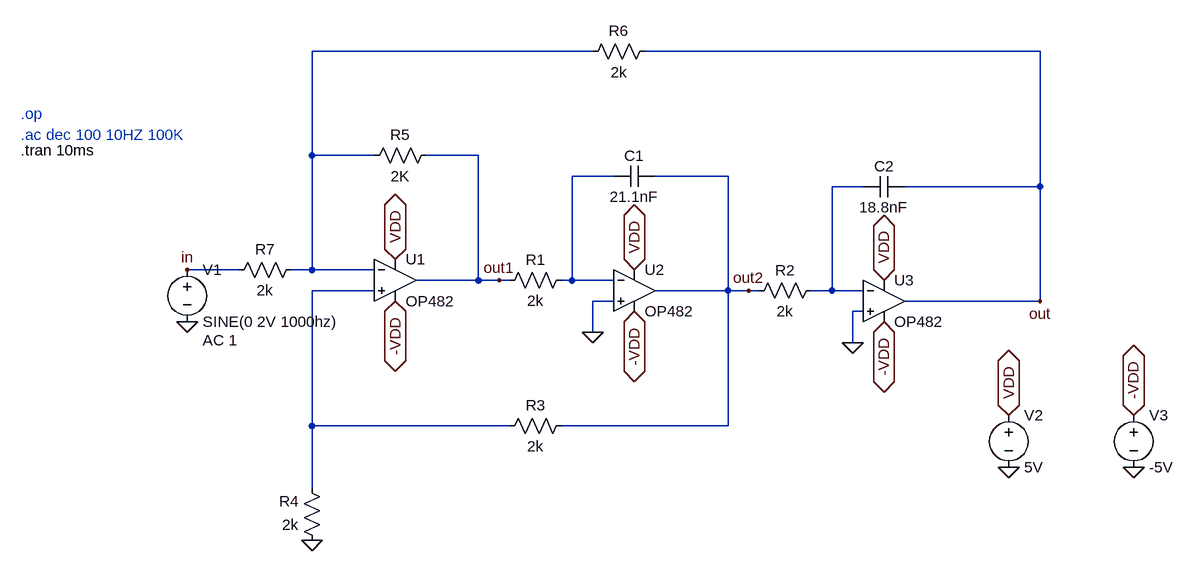
[diagram p0: schematic Draft2.asc]
Draft2.asc, the LTspice schematic file:
Version 4.1
SHEET 1 1144 680
WIRE 224 -320 -208 -320
WIRE 912 -320 304 -320
WIRE -208 -160 -208 -320
WIRE -112 -160 -208 -160
WIRE 48 -160 -32 -160
WIRE 256 -128 192 -128
WIRE 432 -128 320 -128
WIRE 640 -112 592 -112
WIRE 912 -112 912 -320
WIRE 912 -112 704 -112
WIRE -320 16 -400 16
WIRE -208 16 -208 -160
WIRE -208 16 -240 16
WIRE -112 16 -208 16
WIRE 48 32 48 -160
WIRE 48 32 -48 32
WIRE 80 32 48 32
WIRE 96 32 80 32
WIRE 192 32 192 -128
WIRE 192 32 176 32
WIRE 256 32 192 32
WIRE -112 48 -208 48
WIRE 432 48 432 -128
WIRE 432 48 320 48
WIRE 464 48 432 48
WIRE 480 48 464 48
WIRE 592 48 592 -112
WIRE 592 48 560 48
WIRE 640 48 592 48
WIRE 256 64 224 64
WIRE 912 64 912 -112
WIRE 912 64 704 64
WIRE 640 80 624 80
WIRE 224 112 224 64
WIRE 624 128 624 80
WIRE -208 256 -208 48
WIRE 96 256 -208 256
WIRE 432 256 432 48
WIRE 432 256 176 256
WIRE -208 352 -208 256
FLAG 224 112 0
FLAG 624 128 0
FLAG -400 96 0
FLAG -208 432 0
FLAG 864 320 0
FLAG 1056 320 0
FLAG 864 240 VDD
IOPIN 864 240 BiDir
FLAG 672 32 VDD
IOPIN 672 32 BiDir
FLAG 288 16 VDD
IOPIN 288 16 BiDir
FLAG -80 0 VDD
IOPIN -80 0 BiDir
FLAG 1056 240 -VDD
IOPIN 1056 240 BiDir
FLAG 672 96 -VDD
IOPIN 672 96 BiDir
FLAG 288 80 -VDD
IOPIN 288 80 BiDir
FLAG -80 64 -VDD
IOPIN -80 64 BiDir
FLAG 912 64 out
FLAG -400 16 in
FLAG 80 32 out1
FLAG 464 48 out2
SYMBOL OpAmps\\OP482 -80 -32 R0
SYMATTR InstName U1
SYMBOL OpAmps\\OP482 288 -16 R0
SYMATTR InstName U2
SYMBOL OpAmps\\OP482 672 0 R0
SYMATTR InstName U3
SYMBOL res 192 16 R90
WINDOW 0 0 56 VBottom 2
WINDOW 3 32 56 VTop 2
SYMATTR InstName R1
SYMATTR Value 2k
SYMBOL res 576 32 R90
WINDOW 0 0 56 VBottom 2
WINDOW 3 32 56 VTop 2
SYMATTR InstName R2
SYMATTR Value 2k
SYMBOL res 192 240 R90
WINDOW 0 0 56 VBottom 2
WINDOW 3 32 56 VTop 2
SYMATTR InstName R3
SYMATTR Value 2k
SYMBOL res -192 448 R180
WINDOW 0 36 76 Left 2
WINDOW 3 36 40 Left 2
SYMATTR InstName R4
SYMATTR Value 2k
SYMBOL res -128 -144 R270
WINDOW 0 32 56 VTop 2
WINDOW 3 0 56 VBottom 2
SYMATTR InstName R5
SYMATTR Value 2K
SYMBOL res 208 -304 R270
WINDOW 0 32 56 VTop 2
WINDOW 3 0 56 VBottom 2
SYMATTR InstName R6
SYMATTR Value 2k
SYMBOL cap 704 -128 R90
WINDOW 0 0 32 VBottom 2
WINDOW 3 32 32 VTop 2
SYMATTR InstName C2
SYMATTR Value 18.8nF
SYMBOL cap 320 -144 R90
WINDOW 0 0 32 VBottom 2
WINDOW 3 32 32 VTop 2
SYMATTR InstName C1
SYMATTR Value 21.1nF
SYMBOL voltage -400 0 R0
WINDOW 123 24 124 Left 2
WINDOW 39 0 0 Left 0
SYMATTR Value2 AC 1
SYMATTR InstName V1
SYMATTR Value SINE(0 2V 1000hz)
SYMBOL res -224 0 R90
WINDOW 0 0 56 VBottom 2
WINDOW 3 32 56 VTop 2
SYMATTR InstName R7
SYMATTR Value 2k
SYMBOL voltage 864 224 R0
SYMATTR InstName V2
SYMATTR Value 5V
SYMBOL voltage 1056 224 R0
SYMATTR InstName V3
SYMATTR Value -5V
TEXT -656 -192 Left 2 ;.ac dec 100 10HZ 100K
TEXT -656 -224 Left 2 ;.op
TEXT -656 -168 Left 2 !.tran 10ms

The netlist it stands for:
* Draft2.asc
X§U1 N004 N001 VDD -VDD out1 OP482  ; pins In+ In- V+ V- OUT
X§U2 0 N002 VDD -VDD out2 OP482  ; pins In+ In- V+ V- OUT
X§U3 0 N003 VDD -VDD out OP482  ; pins In+ In- V+ V- OUT
R1 N002 out1 2k
R2 N003 out2 2k
R3 out2 N004 2k
R4 0 N004 2k
R5 N001 out1 2K
R6 N001 out 2k
C2 out N003 18.8nF
C1 out2 N002 21.1nF
V1 in 0 SINE(0 2V 1000hz) AC 1
R7 N001 in 2k
V2 VDD 0 5V
V3 -VDD 0 -5V
* .ac dec 100 10HZ 100K
* .op
.tran 10ms
.backanno
.end